# EAGLE schematic Test (EAGLE 8.1.0)
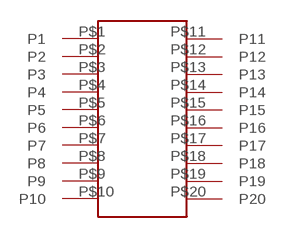
[diagram p0: schematic, sheet 1]

## Parts
U$1  SMALLHEADERPACKAGE  [SMALLHEADERPACKAGE]
Unconnected: U$1.P$1(P1) U$1.P$2(P2) U$1.P$3(P3) U$1.P$4(P4) U$1.P$5(P5) U$1.P$6(P6) U$1.P$7(P7) U$1.P$8(P8) U$1.P$9(P9) U$1.P$10(P10) U$1.P$11(P11) U$1.P$12(P12) U$1.P$13(P13) U$1.P$14(P14) U$1.P$15(P15) U$1.P$16(P16) U$1.P$17(P17) U$1.P$18(P18) U$1.P$19(P19) U$1.P$20(P20)

## Library data of the parts
U$1 = LRA_FlightCPU_Connector:SMALLHEADERPACKAGE